# Altium schematic sheet Boat_Transmitter.SchDoc
size A; SheetNumber: 1; SheetTotal: 3
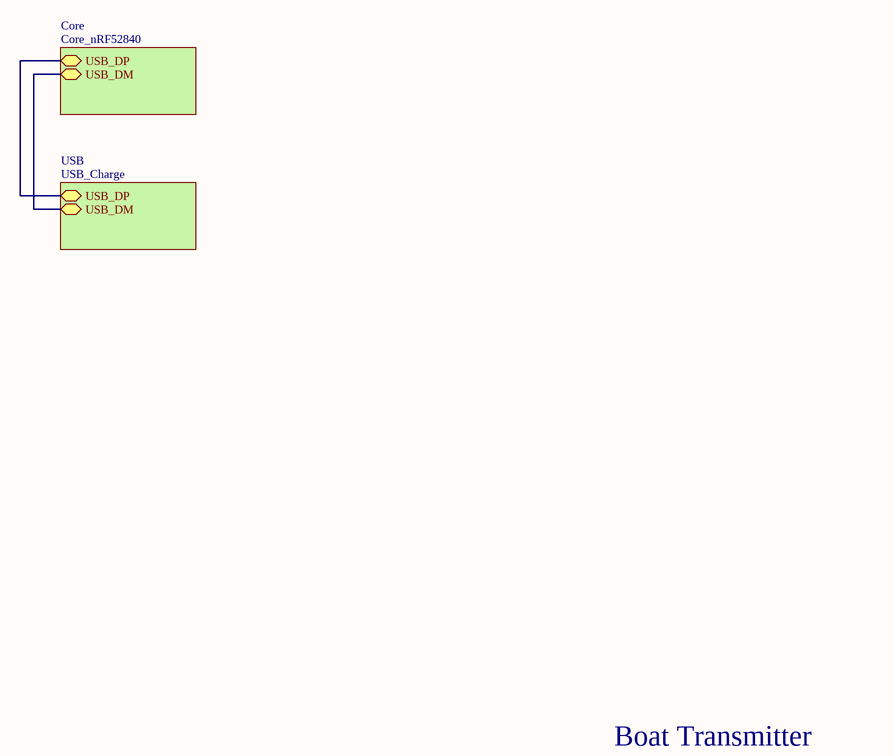
[diagram p0: Boat_Transmitter.SchDoc]

## Sub-sheets
Core = Core_nRF52840: USB_DP (bidir), USB_DM (bidir)
USB = USB_Charge: USB_DP (bidir), USB_DM (bidir)

## Nets
(unnamed): sheet Core/USB_DP, sheet USB/USB_DP
(unnamed): sheet Core/USB_DM, sheet USB/USB_DM

## Notes on the sheet
- Boat Transmitter